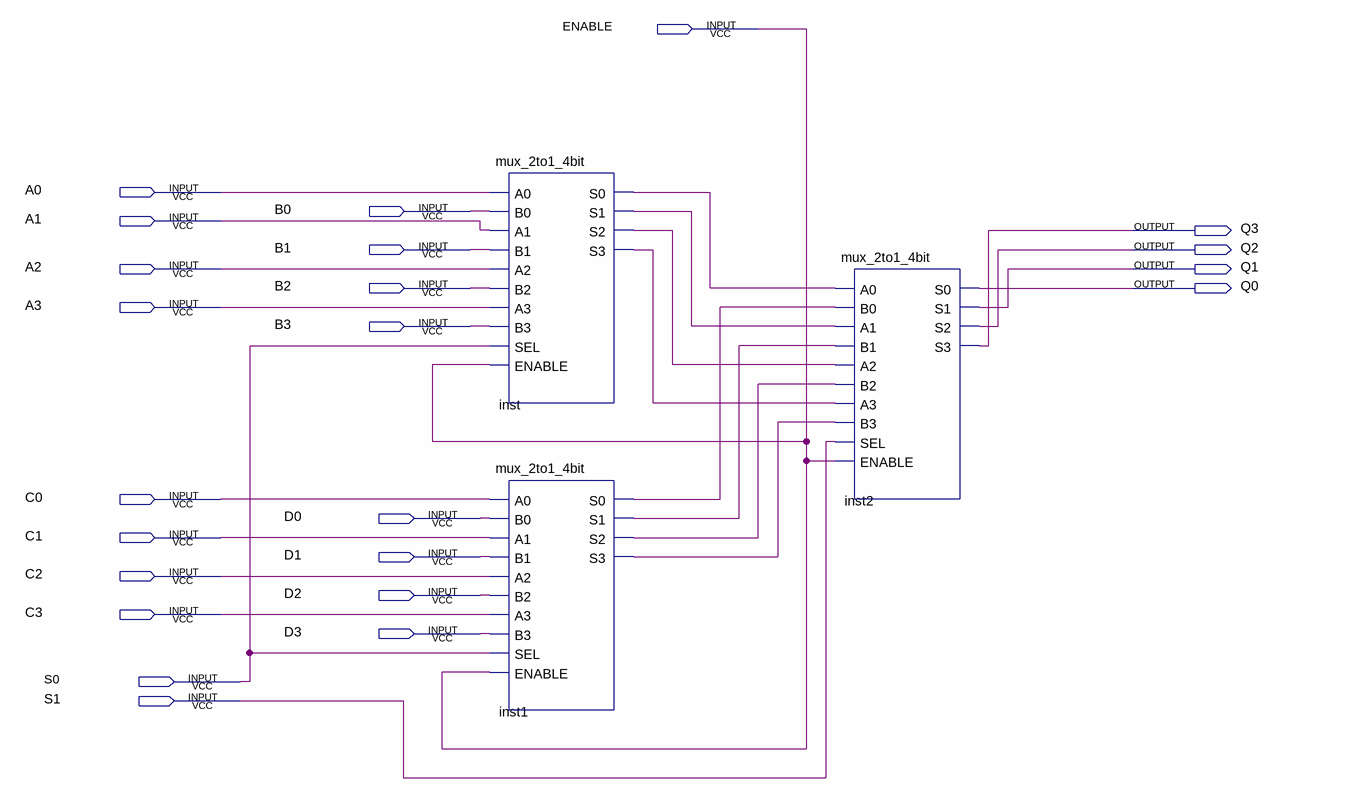
[diagram p0: schematic sheet]
// Quartus schematic mux_4to1_4bit.bdf as structural Verilog: 3 symbols, 23 pins
module mux_4to1_4bit (
  input  ENABLE,
  input  A0,
  input  B0,
  input  A1,
  input  B1,
  input  A2,
  input  B2,
  input  A3,
  input  B3,
  input  C0,
  input  D0,
  input  C1,
  input  D1,
  input  C2,
  input  D2,
  input  C3,
  input  D3,
  input  S0,
  input  S1,
  output Q3,
  output Q2,
  output Q1,
  output Q0
);

  wire inst1_s0, inst1_s1, inst1_s2, inst1_s3, inst_s0, inst_s1, inst_s2, inst_s3;

  mux_2to1_4bit inst (
    .A0(A0), .B0(B0), .A1(A1), .B1(B1), .A2(A2), .B2(B2), .A3(A3), .B3(B3), .SEL(S0), .ENABLE(ENABLE),
    .S0(inst_s0), .S1(inst_s1), .S2(inst_s2), .S3(inst_s3));
  mux_2to1_4bit inst1 (
    .A0(C0), .B0(D0), .A1(C1), .B1(D1), .A2(C2), .B2(D2), .A3(C3), .B3(D3), .SEL(S0), .ENABLE(ENABLE),
    .S0(inst1_s0), .S1(inst1_s1), .S2(inst1_s2), .S3(inst1_s3));
  mux_2to1_4bit inst2 (
    .A0(inst_s0), .B0(inst1_s0), .A1(inst_s1), .B1(inst1_s1), .A2(inst_s2), .B2(inst1_s2), .A3(inst_s3),
    .B3(inst1_s3), .SEL(S1), .ENABLE(ENABLE), .S0(Q0), .S1(Q1), .S2(Q2), .S3(Q3));
endmodule
